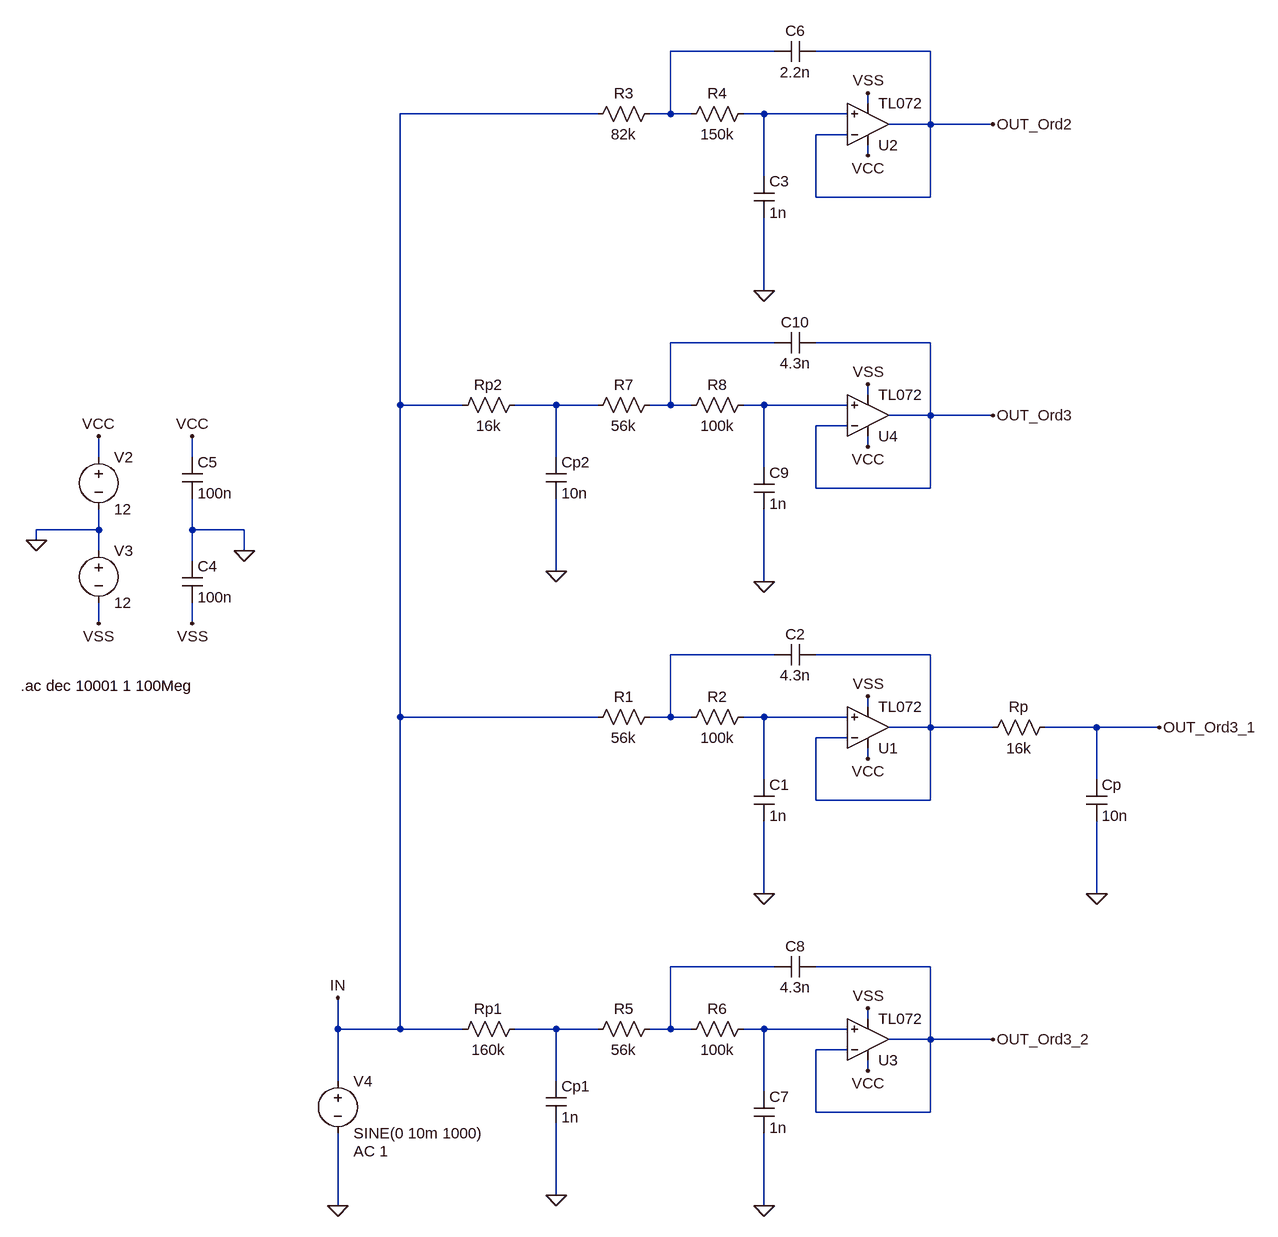
[diagram p0: schematic SK_ordnung3_1kHz_3dB_0dB_butter.asc]
SK_ordnung3_1kHz_3dB_0dB_butter.asc, the LTspice schematic file:
Version 4
SHEET 1 1316 1396
WIRE 432 -432 272 -432
WIRE 672 -432 496 -432
WIRE 576 -352 576 -368
WIRE 160 -336 -144 -336
WIRE 272 -336 272 -432
WIRE 272 -336 240 -336
WIRE 304 -336 272 -336
WIRE 416 -336 384 -336
WIRE 544 -336 416 -336
WIRE 672 -320 672 -432
WIRE 672 -320 608 -320
WIRE 768 -320 672 -320
WIRE 544 -304 496 -304
WIRE 576 -272 576 -288
WIRE 416 -240 416 -336
WIRE 496 -208 496 -304
WIRE 672 -208 672 -320
WIRE 672 -208 496 -208
WIRE 416 -64 416 -176
WIRE 432 16 272 16
WIRE 672 16 496 16
WIRE 576 96 576 80
WIRE -144 112 -144 -336
WIRE -48 112 -144 112
WIRE 96 112 32 112
WIRE 160 112 96 112
WIRE 272 112 272 16
WIRE 272 112 240 112
WIRE 304 112 272 112
WIRE 416 112 384 112
WIRE 544 112 416 112
WIRE 672 128 672 16
WIRE 672 128 608 128
WIRE 768 128 672 128
WIRE 544 144 496 144
WIRE 576 176 576 160
WIRE -608 192 -608 160
WIRE -464 192 -464 160
WIRE 96 192 96 112
WIRE 416 208 416 112
WIRE 496 240 496 144
WIRE 672 240 672 128
WIRE 672 240 496 240
WIRE -608 304 -608 272
WIRE -608 304 -704 304
WIRE -464 304 -464 256
WIRE -384 304 -464 304
WIRE -704 320 -704 304
WIRE -608 336 -608 304
WIRE -384 336 -384 304
WIRE -464 352 -464 304
WIRE 96 368 96 256
WIRE 416 384 416 272
WIRE -608 448 -608 416
WIRE -464 448 -464 416
WIRE 432 496 272 496
WIRE 672 496 496 496
WIRE 576 576 576 560
WIRE -144 592 -144 112
WIRE 160 592 -144 592
WIRE 272 592 272 496
WIRE 272 592 240 592
WIRE 304 592 272 592
WIRE 416 592 384 592
WIRE 544 592 416 592
WIRE 672 608 672 496
WIRE 672 608 608 608
WIRE 768 608 672 608
WIRE 928 608 848 608
WIRE 1024 608 928 608
WIRE 544 624 496 624
WIRE 576 656 576 640
WIRE 416 688 416 592
WIRE 928 688 928 608
WIRE 496 720 496 624
WIRE 672 720 672 608
WIRE 672 720 496 720
WIRE 416 864 416 752
WIRE 928 864 928 752
WIRE 432 976 272 976
WIRE 672 976 496 976
WIRE 576 1056 576 1040
WIRE -240 1072 -240 1024
WIRE -144 1072 -144 592
WIRE -144 1072 -240 1072
WIRE -48 1072 -144 1072
WIRE 96 1072 32 1072
WIRE 160 1072 96 1072
WIRE 272 1072 272 976
WIRE 272 1072 240 1072
WIRE 304 1072 272 1072
WIRE 416 1072 384 1072
WIRE 544 1072 416 1072
WIRE 672 1088 672 976
WIRE 672 1088 608 1088
WIRE 768 1088 672 1088
WIRE 544 1104 496 1104
WIRE 576 1136 576 1120
WIRE -240 1152 -240 1072
WIRE 96 1152 96 1072
WIRE 416 1168 416 1072
WIRE 496 1200 496 1104
WIRE 672 1200 672 1088
WIRE 672 1200 496 1200
WIRE 96 1328 96 1216
WIRE -240 1344 -240 1232
WIRE 416 1344 416 1232
FLAG 416 864 0
FLAG -608 160 VCC
FLAG -608 448 VSS
FLAG 576 560 VSS
FLAG 576 656 VCC
FLAG -704 320 0
FLAG -464 160 VCC
FLAG -464 448 VSS
FLAG -384 336 0
FLAG 1024 608 OUT_Ord3_1
FLAG -240 1024 IN
FLAG 928 864 0
FLAG 416 -64 0
FLAG 576 -368 VSS
FLAG 576 -272 VCC
FLAG 768 -320 OUT_Ord2
FLAG 416 1344 0
FLAG 576 1040 VSS
FLAG 576 1136 VCC
FLAG -240 1344 0
FLAG 768 1088 OUT_Ord3_2
FLAG 96 1328 0
FLAG 416 384 0
FLAG 576 80 VSS
FLAG 576 176 VCC
FLAG 768 128 OUT_Ord3
FLAG 96 368 0
SYMBOL res 256 576 R90
WINDOW 0 0 56 VBottom 2
WINDOW 3 32 56 VTop 2
SYMATTR InstName R1
SYMATTR Value 56k
SYMBOL res 400 576 R90
WINDOW 0 0 56 VBottom 2
WINDOW 3 32 56 VTop 2
SYMATTR InstName R2
SYMATTR Value 100k
SYMBOL cap 400 688 R0
SYMATTR InstName C1
SYMATTR Value 1n
SYMBOL cap 496 480 R90
WINDOW 0 0 32 VBottom 2
WINDOW 3 32 32 VTop 2
SYMATTR InstName C2
SYMATTR Value 4.3n
SYMBOL voltage -608 176 R0
WINDOW 123 0 0 Left 0
WINDOW 39 0 0 Left 0
SYMATTR InstName V2
SYMATTR Value 12
SYMBOL voltage -608 320 R0
WINDOW 123 0 0 Left 0
WINDOW 39 0 0 Left 0
SYMATTR InstName V3
SYMATTR Value 12
SYMBOL cap -480 192 R0
SYMATTR InstName C5
SYMATTR Value 100n
SYMBOL cap -480 352 R0
SYMATTR InstName C4
SYMATTR Value 100n
SYMBOL TL072 576 672 M180
SYMATTR InstName U1
SYMBOL cap 912 688 R0
SYMATTR InstName Cp
SYMATTR Value 10n
SYMBOL res 864 592 R90
WINDOW 0 0 56 VBottom 2
WINDOW 3 32 56 VTop 2
SYMATTR InstName Rp
SYMATTR Value 16k
SYMBOL cap 400 -240 R0
SYMATTR InstName C3
SYMATTR Value 1n
SYMBOL cap 496 -448 R90
WINDOW 0 0 32 VBottom 2
WINDOW 3 32 32 VTop 2
SYMATTR InstName C6
SYMATTR Value 2.2n
SYMBOL TL072 576 -256 M180
SYMATTR InstName U2
SYMBOL res 256 -352 R90
WINDOW 0 0 56 VBottom 2
WINDOW 3 32 56 VTop 2
SYMATTR InstName R3
SYMATTR Value 82k
SYMBOL res 400 -352 R90
WINDOW 0 0 56 VBottom 2
WINDOW 3 32 56 VTop 2
SYMATTR InstName R4
SYMATTR Value 150k
SYMBOL res 256 1056 R90
WINDOW 0 0 56 VBottom 2
WINDOW 3 32 56 VTop 2
SYMATTR InstName R5
SYMATTR Value 56k
SYMBOL res 400 1056 R90
WINDOW 0 0 56 VBottom 2
WINDOW 3 32 56 VTop 2
SYMATTR InstName R6
SYMATTR Value 100k
SYMBOL cap 400 1168 R0
SYMATTR InstName C7
SYMATTR Value 1n
SYMBOL cap 496 960 R90
WINDOW 0 0 32 VBottom 2
WINDOW 3 32 32 VTop 2
SYMATTR InstName C8
SYMATTR Value 4.3n
SYMBOL voltage -240 1136 R0
WINDOW 123 24 124 Left 2
WINDOW 39 0 0 Left 0
SYMATTR Value2 AC 1
SYMATTR InstName V4
SYMATTR Value SINE(0 10m 1000)
SYMBOL TL072 576 1152 M180
SYMATTR InstName U3
SYMBOL cap 80 1152 R0
SYMATTR InstName Cp1
SYMATTR Value 1n
SYMBOL res 48 1056 R90
WINDOW 0 0 56 VBottom 2
WINDOW 3 32 56 VTop 2
SYMATTR InstName Rp1
SYMATTR Value 160k
SYMBOL res 256 96 R90
WINDOW 0 0 56 VBottom 2
WINDOW 3 32 56 VTop 2
SYMATTR InstName R7
SYMATTR Value 56k
SYMBOL res 400 96 R90
WINDOW 0 0 56 VBottom 2
WINDOW 3 32 56 VTop 2
SYMATTR InstName R8
SYMATTR Value 100k
SYMBOL cap 400 208 R0
SYMATTR InstName C9
SYMATTR Value 1n
SYMBOL cap 496 0 R90
WINDOW 0 0 32 VBottom 2
WINDOW 3 32 32 VTop 2
SYMATTR InstName C10
SYMATTR Value 4.3n
SYMBOL TL072 576 192 M180
SYMATTR InstName U4
SYMBOL cap 80 192 R0
SYMATTR InstName Cp2
SYMATTR Value 10n
SYMBOL res 48 96 R90
WINDOW 0 0 56 VBottom 2
WINDOW 3 32 56 VTop 2
SYMATTR InstName Rp2
SYMATTR Value 16k
TEXT -728 544 Left 2 !.ac dec 10001 1 100Meg

The netlist it stands for:
* SK_ordnung3_1kHz_3dB_0dB_butter.asc
R1 N006 IN 56k
R2 N008 N006 100k
C1 N008 0 1n
C2 N007 N006 4.3n
V2 VCC 0 12
V3 0 VSS 12
C5 VCC 0 100n
C4 0 VSS 100n
* U1: TL072 (symbol TL072 not available, pins judged from their places): In+=N008 In-=N007 V+=VCC V-=VSS OUT=N007
Cp OUT_Ord3_1 0 10n
Rp OUT_Ord3_1 N007 16k
C3 N002 0 1n
C6 OUT_Ord2 N001 2.2n
* U2: TL072 (symbol TL072 not available, pins judged from their places): In+=N002 In-=OUT_Ord2 V+=VCC V-=VSS OUT=OUT_Ord2
R3 N001 IN 82k
R4 N002 N001 150k
R5 N009 N010 56k
R6 N011 N009 100k
C7 N011 0 1n
C8 OUT_Ord3_2 N009 4.3n
V4 IN 0 SINE(0 10m 1000) AC 1
* U3: TL072 (symbol TL072 not available, pins judged from their places): In+=N011 In-=OUT_Ord3_2 V+=VCC V-=VSS OUT=OUT_Ord3_2
Cp1 N010 0 1n
Rp1 N010 IN 160k
R7 N003 N004 56k
R8 N005 N003 100k
C9 N005 0 1n
C10 OUT_Ord3 N003 4.3n
* U4: TL072 (symbol TL072 not available, pins judged from their places): In+=N005 In-=OUT_Ord3 V+=VCC V-=VSS OUT=OUT_Ord3
Cp2 N004 0 10n
Rp2 N004 IN 16k
.ac dec 10001 1 100Meg
.backanno
.end